# EAGLE schematic SMS_Voteing - Copy (EAGLE 5.01)
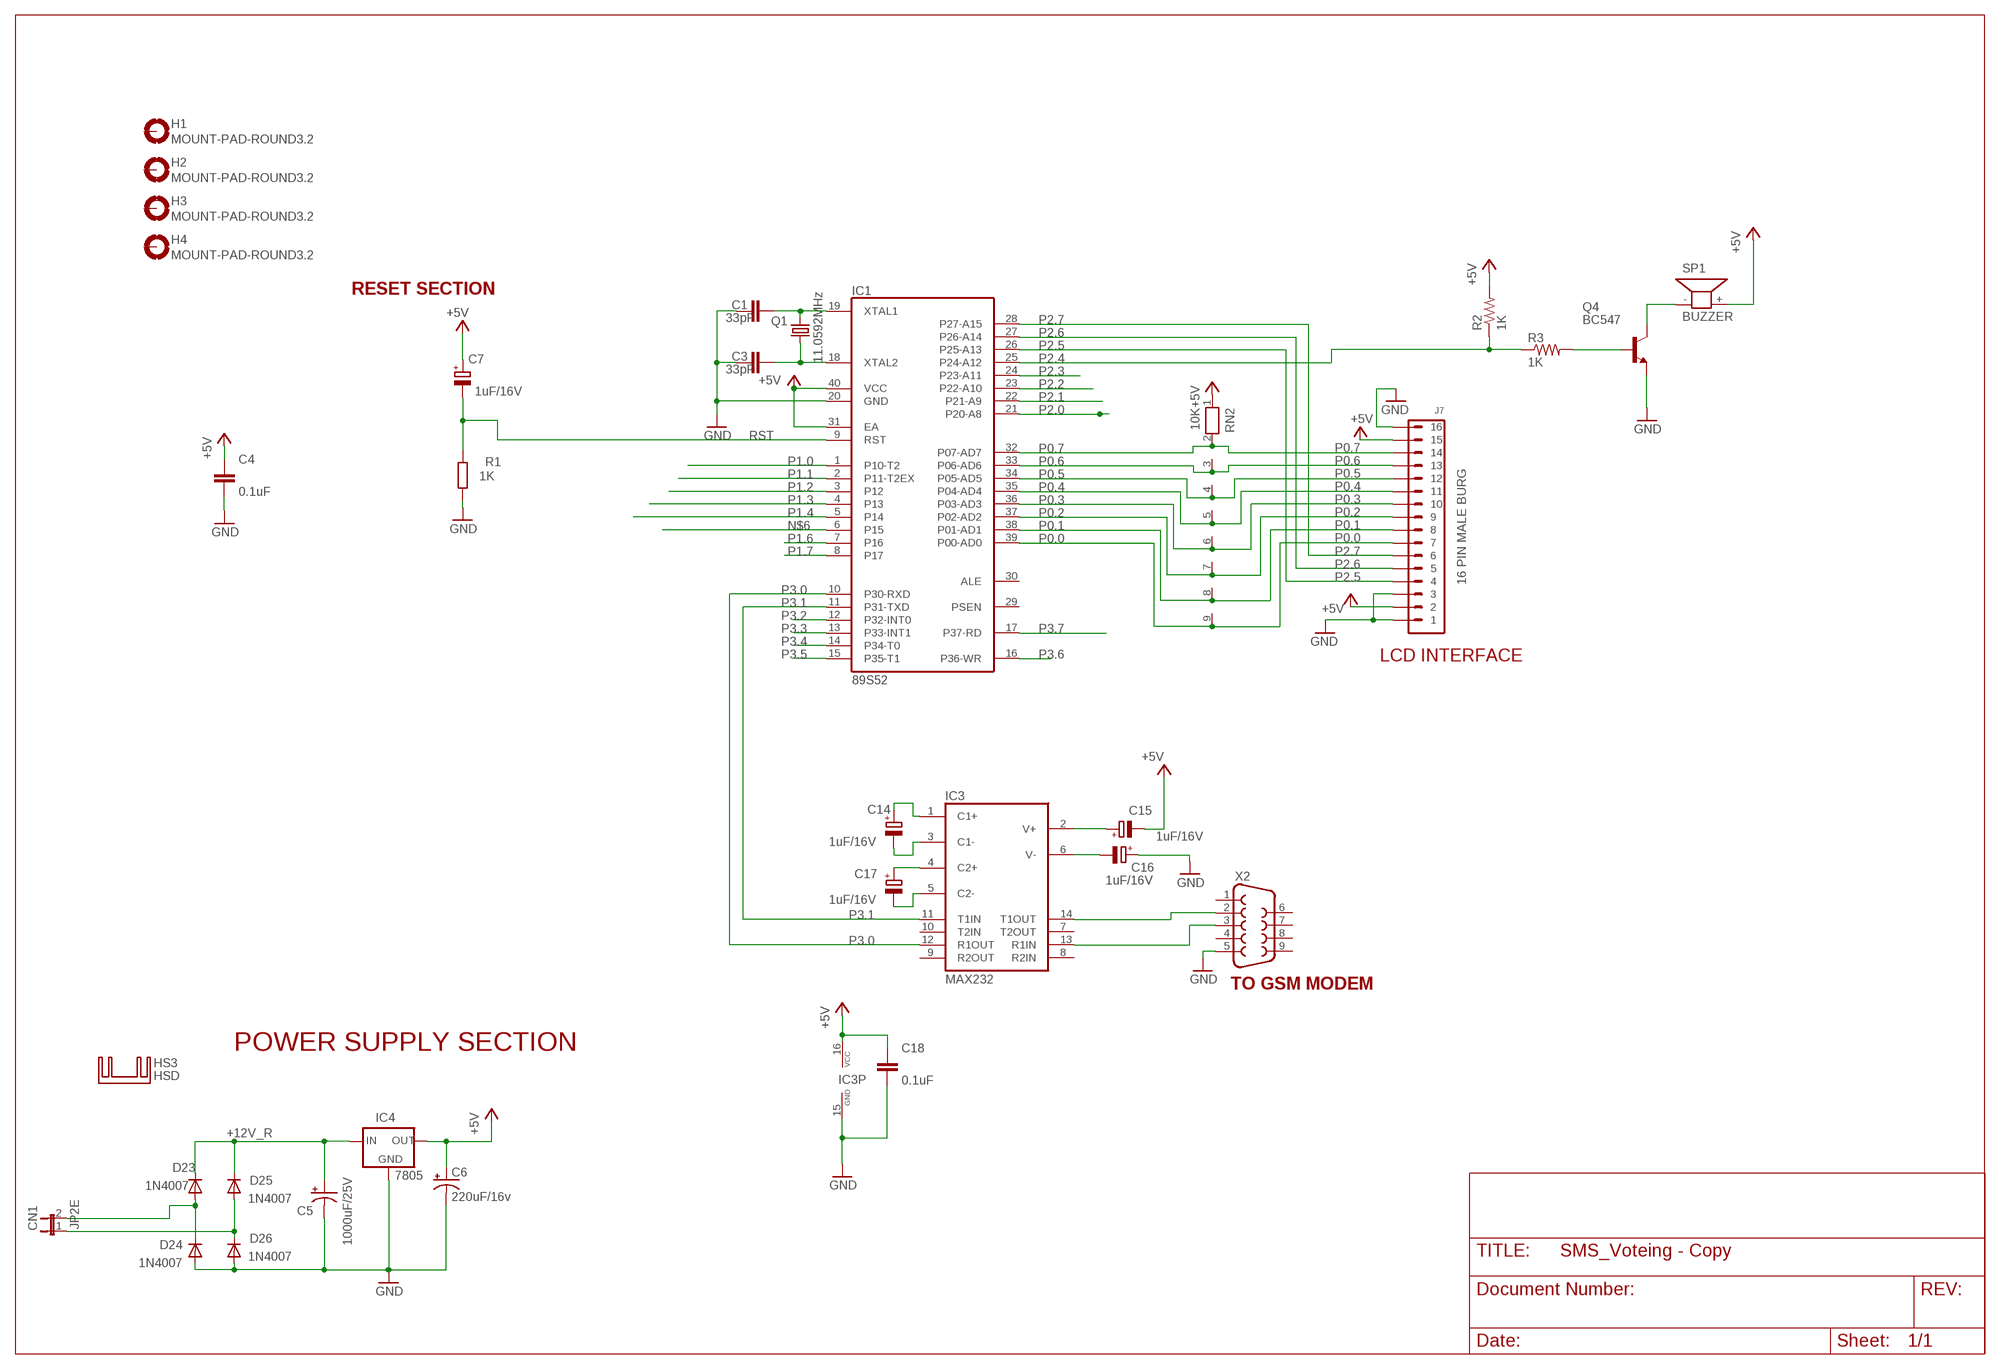
[diagram p0: schematic, sheet 1]

## Parts
C1  33pF  C-EU025-024X044  [C025-024X044]
C3  33pF  C-EU025-024X044  [C025-024X044]
C4  0.1uF  C-EU025-025X050  [C025-025X050]
C5  1000uF/25V  CPOL-USE3.5-10  [E3,5-10]
C6  220uF/16v  CPOL-USE2.5-6  [E2,5-6]
C7  1uF/16V  CPOL-EUE2.5-6  [E2,5-6@1]
C14  1uF/16V  CPOL-EUE2.5-6  [E2,5-6@1]
C15  1uF/16V  CPOL-EUE2.5-6  [E2,5-6@1]
C16  1uF/16V  CPOL-EUE2.5-6  [E2,5-6@1]
C17  1uF/16V  CPOL-EUE2.5-6  [E2,5-6@1]
C18  0.1uF  C-EU025-025X050  [C025-025X050]
CN1  JP2E  [JP2]
D23  1N4007  1N4004  [DO41-10]
D24  1N4007  1N4004  [DO41-10]
D25  1N4007  1N4004  [DO41-10]
D26  1N4007  1N4004  [DO41-10]
H1  MOUNT-PAD-ROUND3.2  [3,2-PAD]
H2  MOUNT-PAD-ROUND3.2  [3,2-PAD]
H3  MOUNT-PAD-ROUND3.2  [3,2-PAD]
H4  MOUNT-PAD-ROUND3.2  [3,2-PAD]
HS3  HSD  [HEATSINK]
IC1  89S52  8052N  [DIL40]
IC3  MAX232  [DIL16]
IC4  7805  78XXS  [78XXS]
J7  16 PIN MALE BURG  JP16  [JP16]
Q1  11.0592MHz  CRYSTALHC49S  [HC49/S]
Q4  BC547  [TO92]
R1  1K  R-EU_0207/10  [0207/10]
R2  1K  R-US_0207/10  [0207/10]
R3  1K  R-US_0207/10  [0207/10]
RN2  10K  RN08  [RN-9]
SP1  BUZZER  AL11P  [AL11P]
X2  F09HP  [F09HP]

## Nets
+5V: C4.2 C6.+ C7.+ C15.- C18.2 IC1.31(EA) IC1.40(VCC) IC3.16(VCC) IC4.OUT J7.2 J7.15 R2.2 RN2.1 SP1.+
+12V_R: C5.+ D23.C D25.C IC4.IN
GND: C1.1 C3.1 C4.1 C5.- C6.- C16.+ C18.1 D24.A D26.A IC1.20(GND) IC3.15(GND) IC4.GND J7.1 J7.3 J7.16 Q4.1(E) R1.2 X2.5
N$1: IC3.14(T1OUT) X2.2
N$3: IC3.13(R1IN) X2.3
N$6: IC1.6(P15)
N$10: C14.+ IC3.1(C1+)
N$12: C14.- IC3.3(C1-)
N$13: C17.+ IC3.4(C2+)
N$14: C17.- IC3.5(C2-)
N$15: C15.+ IC3.2(V+)
N$16: C16.- IC3.6(V-)
N$18: CN1.1 D25.A D26.C
N$22: C3.2 IC1.18(XTAL2) Q1.1
N$23: C1.2 IC1.19(XTAL1) Q1.2
N$24: Q4.2(B) R3.2
N$25: Q4.3(C) SP1.-
N$56: CN1.2 D23.A D24.C
P0.0: IC1.39(P00-AD0) J7.7 RN2.9
P0.1: IC1.38(P01-AD1) J7.8 RN2.8
P0.2: IC1.37(P02-AD2) J7.9 RN2.7
P0.3: IC1.36(P03-AD3) J7.10 RN2.6
P0.4: IC1.35(P04-AD4) J7.11 RN2.5
P0.5: IC1.34(P05-AD5) J7.12 RN2.4
P0.6: IC1.33(P06-AD6) J7.13 RN2.3
P0.7: IC1.32(P07-AD7) J7.14 RN2.2
P1.0: IC1.1(P10-T2)
P1.1: IC1.2(P11-T2EX)
P1.2: IC1.3(P12)
P1.3: IC1.4(P13)
P1.4: IC1.5(P14)
P1.6: IC1.7(P16)
P1.7: IC1.8(P17)
P2.0: IC1.21(P20-A8)
P2.1: IC1.22(P21-A9)
P2.2: IC1.23(P22-A10)
P2.3: IC1.24(P23-A11)
P2.4: IC1.25(P24-A12) R2.1 R3.1
P2.5: IC1.26(P25-A13) J7.4
P2.6: IC1.27(P26-A14) J7.5
P2.7: IC1.28(P27-A15) J7.6
P3.0: IC1.10(P30-RXD) IC3.12(R1OUT)
P3.1: IC1.11(P31-TXD) IC3.11(T1IN)
P3.2: IC1.12(P32-INT0)
P3.3: IC1.13(P33-INT1)
P3.4: IC1.14(P34-T0)
P3.5: IC1.15(P35-T1)
P3.6: IC1.16(P36-WR)
P3.7: IC1.17(P37-RD)
RST: C7.- IC1.9(RST) R1.1
Unconnected: H1.B3,2(MOUNT) H2.B3,2(MOUNT) H3.B3,2(MOUNT) H4.B3,2(MOUNT) IC1.29(PSEN) IC1.30(ALE) IC3.7(T2OUT) IC3.8(R2IN) IC3.9(R2OUT) IC3.10(T2IN) X2.1 X2.4 X2.6 X2.7 X2.8 X2.9

## Notes on the sheet
- RESET SECTION
- LCD INTERFACE
- TO GSM MODEM
- POWER SUPPLY SECTION

## Library data of the parts
C1 C3 C4 C18 = resistor:C-EU: CAPACITOR, European symbol
C5 C6 = resistor:CPOL-US: POLARIZED CAPACITOR, American symbol
C7 C14-C17 = resistor:CPOL-EU: POLARIZED CAPACITOR, European symbol
CN1 = relimate:JP2E
D23-D26 = diode:1N4004: DIODE general purpose rectifier, 1 A
H1-H4 = holes:MOUNT-PAD-ROUND: MOUNTING PAD, round
HS3 = HEATSINK:HS
IC1 = micro-intel:8052: MICROCOMPUTER/PERIPHERAL DEVICE 80C51/87C51/80C52/87C52 80C51 8-bit microcontroller family 4 K/8 K OTP/ROM low voltage (2.7 V-5.5 V), low power, high speed (33 MHz), 128/256 B RAM Source: www.semiconductors.philips.com .. 8XC51_8XC52_6.pdf
IC3 = maxim:MAX232: RS232 TRANSEIVER
IC4 = v-reg:78XXS: VOLTAGE REGULATOR
J7 = relimate:JP16
Q1 = crystal:CRYSTAL: CRYSTAL
Q4 = transistor-npn:BC547*: NPN Transistor
R1 = resistor:R-EU_: RESISTOR, European symbol
R2 R3 = resistor:R-US_: RESISTOR, American symbol
RN2 = resistor-net:RN08: RESISTOR NETWORK
SP1 = buzzer:AL11P: SPEAKER Source: Buerklin
X2 = con-subd:F09: SUB-D